# Altium schematic sheet top.SchDoc
size A
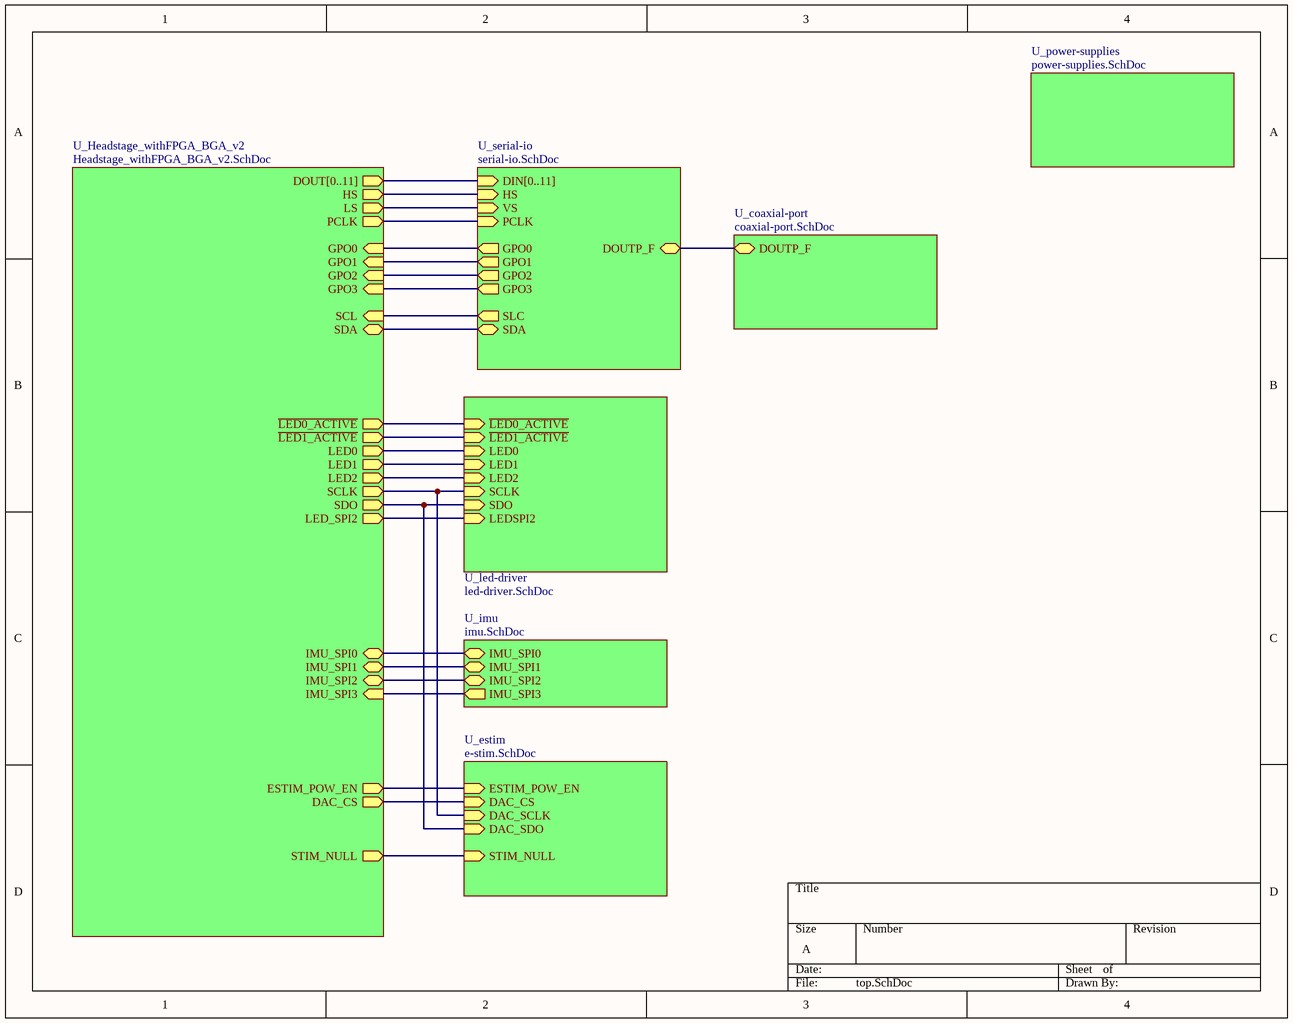
[diagram p0: top.SchDoc]

## Sub-sheets
U_coaxial-port = coaxial-port.SchDoc: DOUTP_F (bidir)
U_estim = e-stim.SchDoc: ESTIM_POW_EN (in), DAC_CS (in), DAC_SCLK (in), DAC_SDO (in), STIM_NULL (in)
U_Headstage_withFPGA_BGA_v2 = Headstage_withFPGA_BGA_v2.SchDoc: DOUT[0..11] (out), HS (out), LS (out), PCLK (out), GPO3 (in), GPO2 (in), GPO1 (in), SDA (bidir), SCL (in), GPO0 (in), ~{LED0_ACTIVE} (out), ~{LED1_ACTIVE} (out), LED0 (out), LED1 (out), LED2 (out), SCLK (out), SDO (out), LED_SPI2 (out), IMU_SPI0 (bidir), IMU_SPI1 (bidir), IMU_SPI2 (bidir), IMU_SPI3 (in), ESTIM_POW_EN (out), DAC_CS (out), STIM_NULL (out)
U_imu = imu.SchDoc: IMU_SPI0 (bidir), IMU_SPI1 (bidir), IMU_SPI2 (bidir), IMU_SPI3 (out)
U_led-driver = led-driver.SchDoc: ~{LED0_ACTIVE} (in), ~{LED1_ACTIVE} (in), SCLK (in), LED0 (in), LED1 (in), LED2 (in), SDO (in), LEDSPI2 (in)
U_power-supplies = power-supplies.SchDoc: no entries
U_serial-io = serial-io.SchDoc: DIN[0..11] (in), HS (in), VS (in), PCLK (in), DOUTP_F (bidir), SDA (bidir), SLC (out), GPO0 (out), GPO1 (out), GPO2 (out), GPO3 (out)

## Nets
(unnamed): sheet U_coaxial-port/DOUTP_F, sheet U_serial-io/DOUTP_F
(unnamed): sheet U_serial-io/HS, sheet U_Headstage_withFPGA_BGA_v2/HS
(unnamed): sheet U_serial-io/VS, sheet U_Headstage_withFPGA_BGA_v2/LS
(unnamed): sheet U_serial-io/PCLK, sheet U_Headstage_withFPGA_BGA_v2/PCLK
(unnamed): sheet U_serial-io/SDA, sheet U_Headstage_withFPGA_BGA_v2/SDA
(unnamed): sheet U_serial-io/SLC, sheet U_Headstage_withFPGA_BGA_v2/SCL
(unnamed): sheet U_serial-io/GPO0, sheet U_Headstage_withFPGA_BGA_v2/GPO0
(unnamed): sheet U_serial-io/GPO1, sheet U_Headstage_withFPGA_BGA_v2/GPO1
(unnamed): sheet U_serial-io/GPO2, sheet U_Headstage_withFPGA_BGA_v2/GPO2
(unnamed): sheet U_serial-io/GPO3, sheet U_Headstage_withFPGA_BGA_v2/GPO3
(unnamed): sheet U_Headstage_withFPGA_BGA_v2/~{LED0_ACTIVE}, sheet U_led-driver/~{LED0_ACTIVE}
(unnamed): sheet U_Headstage_withFPGA_BGA_v2/~{LED1_ACTIVE}, sheet U_led-driver/~{LED1_ACTIVE}
(unnamed): sheet U_Headstage_withFPGA_BGA_v2/LED0, sheet U_led-driver/LED0
(unnamed): sheet U_Headstage_withFPGA_BGA_v2/LED1, sheet U_led-driver/LED1
(unnamed): sheet U_Headstage_withFPGA_BGA_v2/LED2, sheet U_led-driver/LED2
(unnamed): sheet U_Headstage_withFPGA_BGA_v2/SCLK, sheet U_led-driver/SCLK, sheet U_estim/DAC_SCLK
(unnamed): sheet U_Headstage_withFPGA_BGA_v2/SDO, sheet U_led-driver/SDO, sheet U_estim/DAC_SDO
(unnamed): sheet U_Headstage_withFPGA_BGA_v2/LED_SPI2, sheet U_led-driver/LEDSPI2
(unnamed): sheet U_Headstage_withFPGA_BGA_v2/IMU_SPI0, sheet U_imu/IMU_SPI0
(unnamed): sheet U_Headstage_withFPGA_BGA_v2/IMU_SPI1, sheet U_imu/IMU_SPI1
(unnamed): sheet U_Headstage_withFPGA_BGA_v2/IMU_SPI2, sheet U_imu/IMU_SPI2
(unnamed): sheet U_Headstage_withFPGA_BGA_v2/IMU_SPI3, sheet U_imu/IMU_SPI3
(unnamed): sheet U_Headstage_withFPGA_BGA_v2/ESTIM_POW_EN, sheet U_estim/ESTIM_POW_EN
(unnamed): sheet U_Headstage_withFPGA_BGA_v2/DAC_CS, sheet U_estim/DAC_CS
(unnamed): sheet U_Headstage_withFPGA_BGA_v2/STIM_NULL, sheet U_estim/STIM_NULL

## Buses and harness runs
bus sheet U_Headstage_withFPGA_BGA_v2/DOUT[0..11] = sheet U_serial-io/DIN[0..11]